# Altium schematic sheet BPF.SchDoc: BPF
size A2 portrait; DocumentNumber: 13; Revision: 1.9; SheetNumber: 13; SheetTotal: 18; DocumentName: Лист 1.SCHDOC
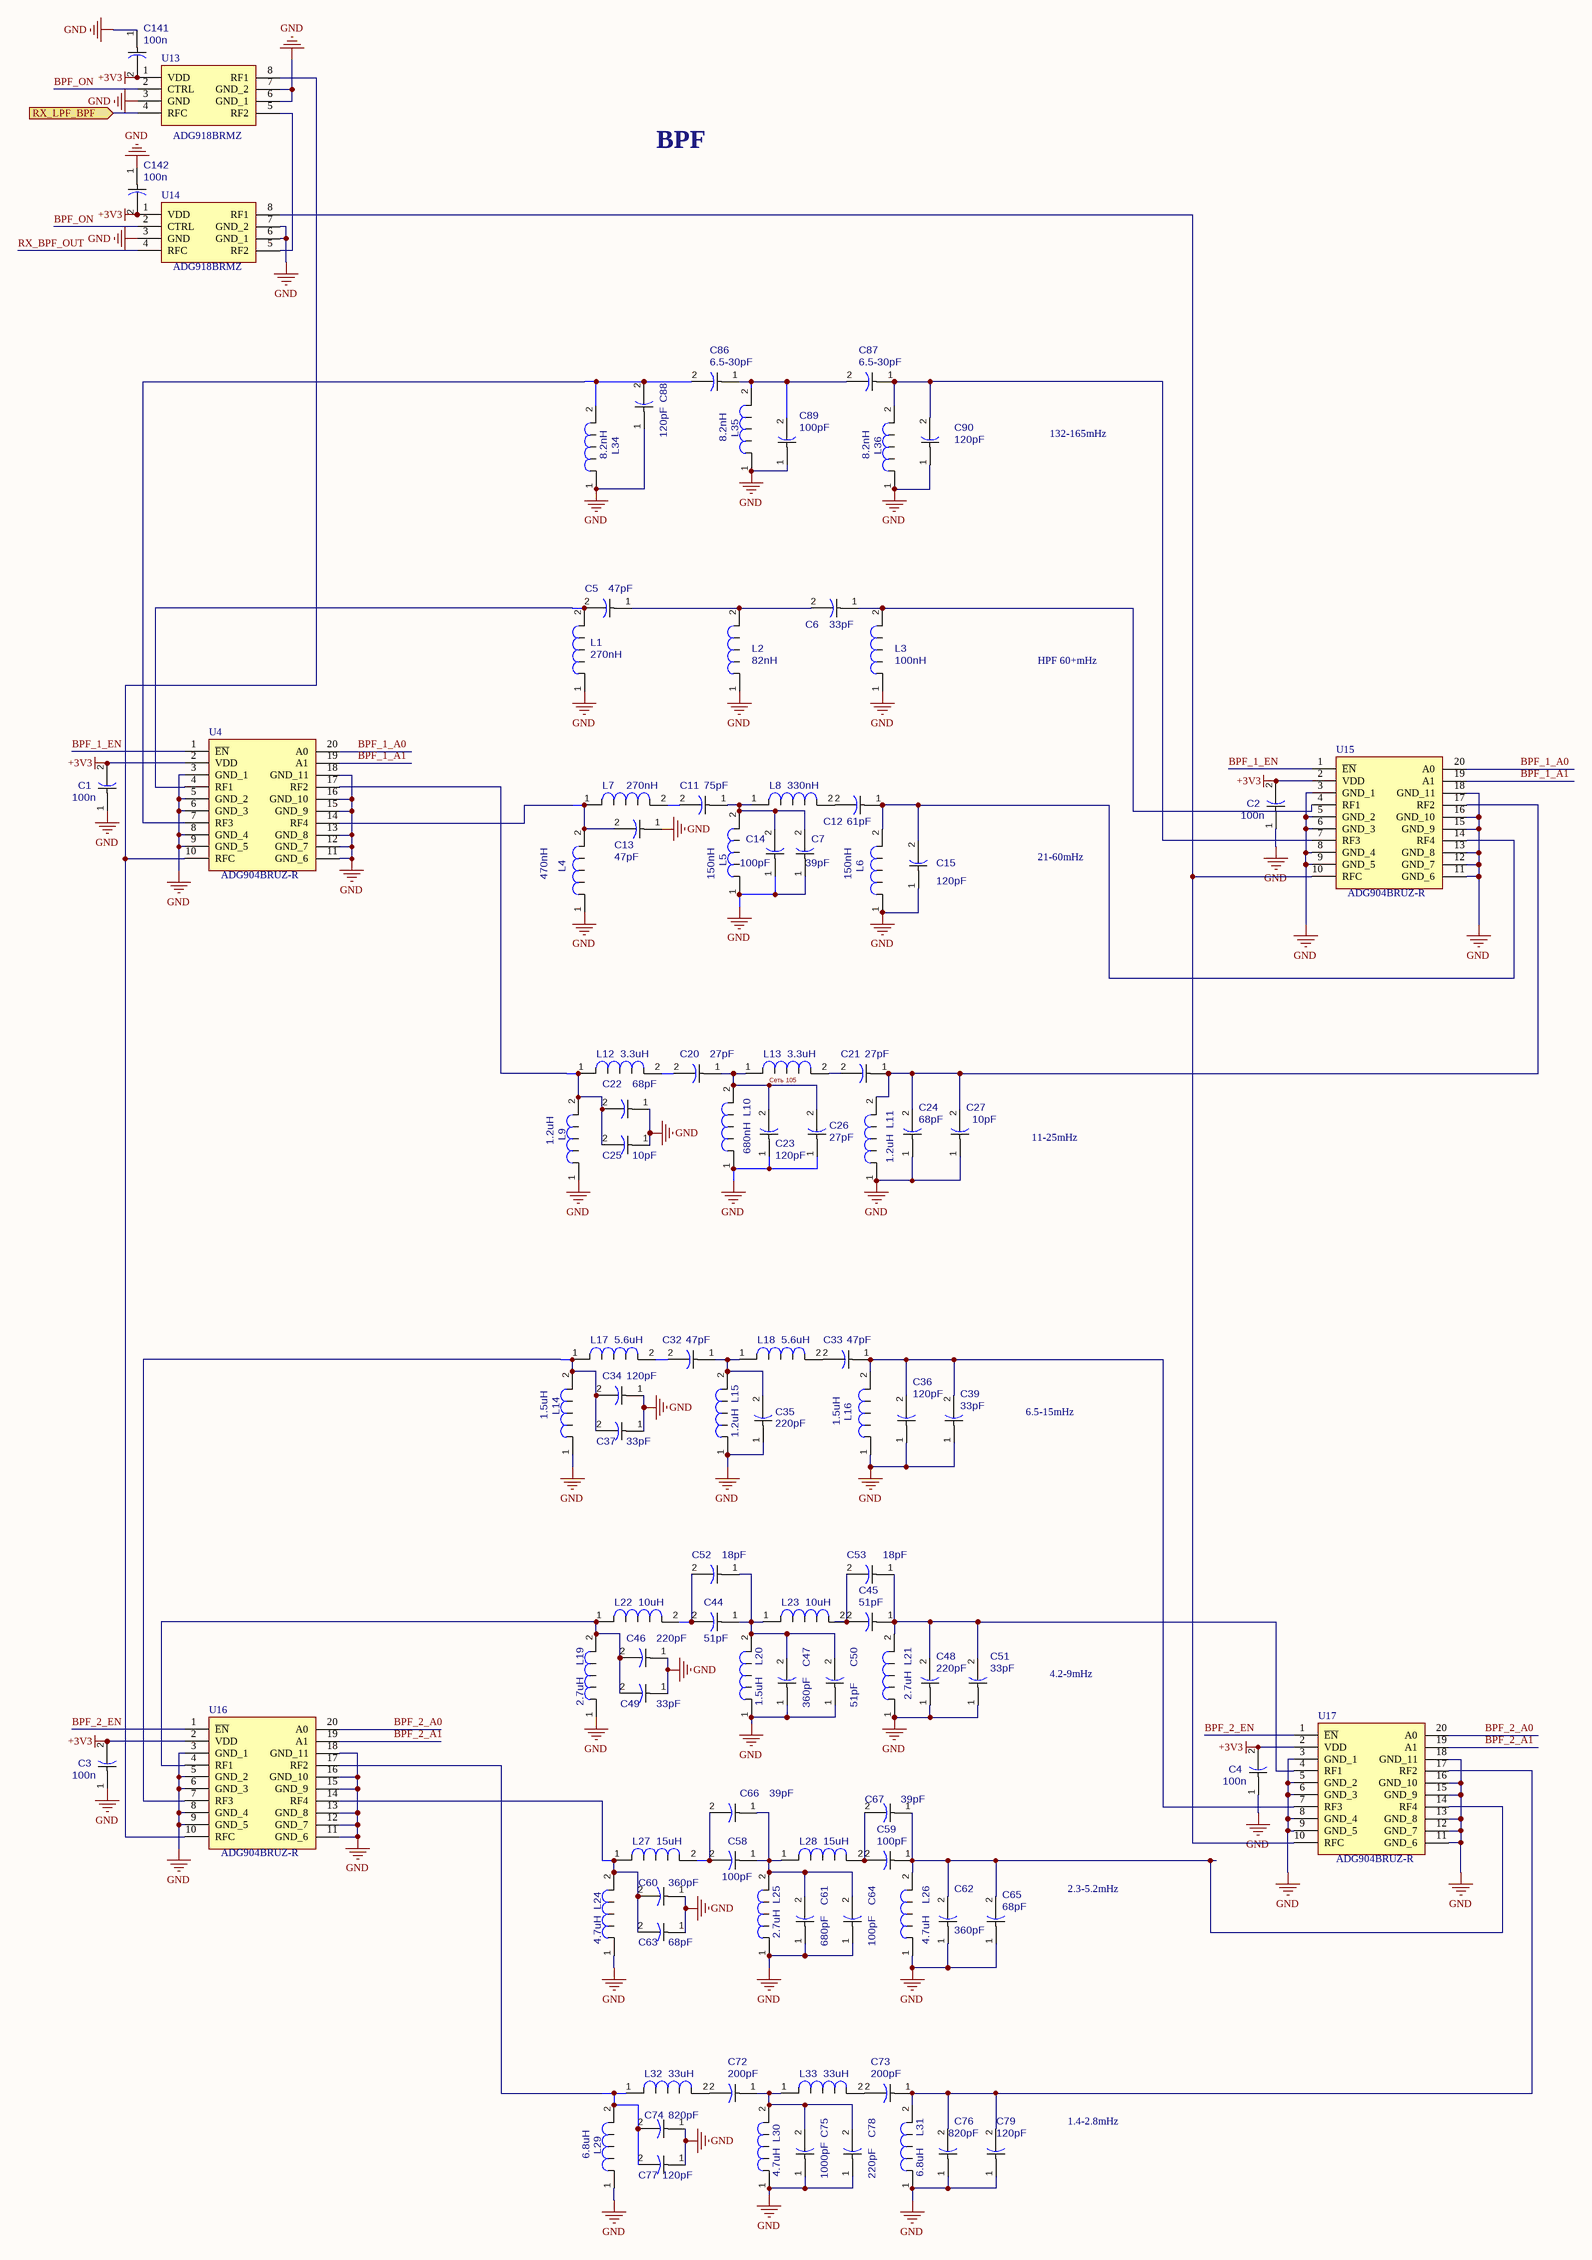
[diagram p0: BPF.SchDoc]

## Parts
C1  value 100n  [CAP_0805]  (hidden comment: CAP_0805)
C2  value 100n  [CAP_0805]  (hidden comment: CAP_0805)
C3  value 100n  [CAP_0805]  (hidden comment: CAP_0805)
C4  value 100n  [CAP_0805]  (hidden comment: CAP_0805)
C5  value 47pF  [CAP_0805]  (hidden comment: CAP_0805)
C6  value 33pF  [CAP_0805]  (hidden comment: CAP_0805)
C7  value 39pF  [CAP_0805]  (hidden comment: CAP_0805)
C11  value 75pF  [CAP_0805]  (hidden comment: CAP_0805)
C12  value 61pF  [CAP_0805]  (hidden comment: CAP_0805)
C13  value 47pF  [CAP_0805]  (hidden comment: CAP_0805)
C14  value 100pF  [CAP_0805]  (hidden comment: CAP_0805)
C15  value 120pF  [CAP_0805]  (hidden comment: CAP_0805)
C20  value 27pF  [CAP_0805]  (hidden comment: CAP_0805)
C21  value 27pF  [CAP_0805]  (hidden comment: CAP_0805)
C22  value 68pF  [CAP_0805]  (hidden comment: CAP_0805)
C23  value 120pF  [CAP_0805]  (hidden comment: CAP_0805)
C24  value 68pF  [CAP_0805]  (hidden comment: CAP_0805)
C25  value 10pF  [CAP_0805]  (hidden comment: CAP_0805)
C26  value 27pF  [CAP_0805]  (hidden comment: CAP_0805)
C27  value 10pF  [CAP_0805]  (hidden comment: CAP_0805)
C32  value 47pF  [CAP_0805]  (hidden comment: CAP_0805)
C33  value 47pF  [CAP_0805]  (hidden comment: CAP_0805)
C34  value 120pF  [CAP_0805]  (hidden comment: CAP_0805)
C35  value 220pF  [CAP_0805]  (hidden comment: CAP_0805)
C36  value 120pF  [CAP_0805]  (hidden comment: CAP_0805)
C37  value 33pF  [CAP_0805]  (hidden comment: CAP_0805)
C39  value 33pF  [CAP_0805]  (hidden comment: CAP_0805)
C44  value 51pF  [CAP_0805]  (hidden comment: CAP_0805)
C45  value 51pF  [CAP_0805]  (hidden comment: CAP_0805)
C46  value 220pF  [CAP_0805]  (hidden comment: CAP_0805)
C47  value 360pF  [CAP_0805]  (hidden comment: CAP_0805)
C48  value 220pF  [CAP_0805]  (hidden comment: CAP_0805)
C49  value 33pF  [CAP_0805]  (hidden comment: CAP_0805)
C50  value 51pF  [CAP_0805]  (hidden comment: CAP_0805)
C51  value 33pF  [CAP_0805]  (hidden comment: CAP_0805)
C52  value 18pF  [CAP_0805]  (hidden comment: CAP_0805)
C53  value 18pF  [CAP_0805]  (hidden comment: CAP_0805)
C58  value 100pF  [CAP_0805]  (hidden comment: CAP_0805)
C59  value 100pF  [CAP_0805]  (hidden comment: CAP_0805)
C60  value 360pF  [CAP_0805]  (hidden comment: CAP_0805)
C61  value 680pF  [CAP_0805]  (hidden comment: CAP_0805)
C62  value 360pF  [CAP_0805]  (hidden comment: CAP_0805)
C63  value 68pF  [CAP_0805]  (hidden comment: CAP_0805)
C64  value 100pF  [CAP_0805]  (hidden comment: CAP_0805)
C65  value 68pF  [CAP_0805]  (hidden comment: CAP_0805)
C66  value 39pF  [CAP_0805]  (hidden comment: CAP_0805)
C67  value 39pF  [CAP_0805]  (hidden comment: CAP_0805)
C72  value 200pF  [CAP_0805]  (hidden comment: CAP_0805)
C73  value 200pF  [CAP_0805]  (hidden comment: CAP_0805)
C74  value 820pF  [CAP_0805]  (hidden comment: CAP_0805)
C75  value 1000pF  [CAP_0805]  (hidden comment: CAP_0805)
C76  value 820pF  [CAP_0805]  (hidden comment: CAP_0805)
C77  value 120pF  [CAP_0805]  (hidden comment: CAP_0805)
C78  value 220pF  [CAP_0805]  (hidden comment: CAP_0805)
C79  value 120pF  [CAP_0805]  (hidden comment: CAP_0805)
C86  value 6.5-30pF  [5025[2010]]  (hidden comment: CAP_0805)
C87  value 6.5-30pF  [5025[2010]]  (hidden comment: CAP_0805)
C88  value 120pF  [CAP_0805]  (hidden comment: CAP_0805)
C89  value 100pF  [CAP_0805]  (hidden comment: CAP_0805)
C90  value 120pF  [CAP_0805]  (hidden comment: CAP_0805)
C141  value 100n  [CAP_0805]  (hidden comment: CAP_0805)
C142  value 100n  [CAP_0805]  (hidden comment: CAP_0805)
L1  value 270nH  [IND_0805]  (hidden comment: IND_0805)
L2  value 82nH  [IND_0805]  (hidden comment: IND_0805)
L3  value 100nH  [IND_0805]  (hidden comment: IND_0805)
L4  value 470nH  [IND_0805]  (hidden comment: IND_0805)
L5  value 150nH  [IND_0805]  (hidden comment: IND_0805)
L6  value 150nH  [IND_0805]  (hidden comment: IND_0805)
L7  value 270nH  [IND_0805]  (hidden comment: IND_0805)
L8  value 330nH  [IND_0805]  (hidden comment: IND_0805)
L9  value 1.2uH  [IND_0805]  (hidden comment: IND_0805)
L10  value 680nH  [IND_0805]  (hidden comment: IND_0805)
L11  value 1.2uH  [IND_0805]  (hidden comment: IND_0805)
L12  value 3.3uH  [IND_0805]  (hidden comment: IND_0805)
L13  value 3.3uH  [IND_0805]  (hidden comment: IND_0805)
L14  value 1.5uH  [IND_0805]  (hidden comment: IND_0805)
L15  value 1.2uH  [IND_0805]  (hidden comment: IND_0805)
L16  value 1.5uH  [IND_0805]  (hidden comment: IND_0805)
L17  value 5.6uH  [IND_0805]  (hidden comment: IND_0805)
L18  value 5.6uH  [IND_0805]  (hidden comment: IND_0805)
L19  value 2.7uH  [IND_0805]  (hidden comment: IND_0805)
L20  value 1.5uH  [IND_0805]  (hidden comment: IND_0805)
L21  value 2.7uH  [IND_0805]  (hidden comment: IND_0805)
L22  value 10uH  [IND_0805]  (hidden comment: IND_0805)
L23  value 10uH  [IND_0805]  (hidden comment: IND_0805)
L24  value 4.7uH  [IND_0805]  (hidden comment: IND_0805)
L25  value 2.7uH  [IND_0805]  (hidden comment: IND_0805)
L26  value 4.7uH  [IND_0805]  (hidden comment: IND_0805)
L27  value 15uH  [IND_0805]  (hidden comment: IND_0805)
L28  value 15uH  [IND_0805]  (hidden comment: IND_0805)
L29  value 6.8uH  [IND_0805]  (hidden comment: IND_0805)
L30  value 4.7uH  [IND_0805]  (hidden comment: IND_0805)
L31  value 6.8uH  [IND_0805]  (hidden comment: IND_0805)
L32  value 33uH  [IND_0805]  (hidden comment: IND_0805)
L33  value 33uH  [IND_0805]  (hidden comment: IND_0805)
L34  value 8.2nH  [IND_0805]  (hidden comment: IND_0805)
L35  value 8.2nH  [IND_0805]  (hidden comment: IND_0805)
L36  value 8.2nH  [IND_0805]  (hidden comment: IND_0805)
U4  ADG904BRUZ-R  [SOP65P640X120-20N]
U13  ADG918BRMZ  [SOP65P490X110-8N]
U14  ADG918BRMZ  [SOP65P490X110-8N]
U15  ADG904BRUZ-R  [SOP65P640X120-20N]
U16  ADG904BRUZ-R  [SOP65P640X120-20N]
U17  ADG904BRUZ-R  [SOP65P640X120-20N]

## Ports
RX_LPF_BPF (in)

## Nets
+3V3: C1.2 C2.2 C3.2 C4.2 C141.2 C142.2 U4.2(VDD) U13.1(VDD) U14.1(VDD) U15.2(VDD) U16.2(VDD) U17.2(VDD)
GND: C1.1 C2.1 C3.1 C4.1 C7.1 C13.1 C14.1 C15.1 C22.1 C23.1 C24.1 C25.1 C26.1 C27.1 C34.1 C35.1 C36.1 C37.1 C39.1 C46.1 C47.1 C48.1 C49.1 C50.1 C51.1 C60.1 C61.1 C62.1 C63.1 C64.1 C65.1 C74.1 C75.1 C76.1 C77.1 C78.1 C79.1 C88.1 C89.1 C90.1 C141.1 C142.1 L1.1 L2.1 L3.1 L4.1 L5.1 L6.1 L9.1 L10.1 L11.1 L14.1 L15.1 L16.1 L19.1 L20.1 L21.1 L24.1 L25.1 L26.1 L29.1 L30.1 L31.1 L34.1 L35.1 L36.1 U4.3(GND_1) U4.5(GND_2) U4.6(GND_3) U4.8(GND_4) U4.9(GND_5) U4.11(GND_6) U4.12(GND_7) U4.13(GND_8) U4.15(GND_9) U4.16(GND_10) U4.18(GND_11) U13.3(GND) U13.6(GND_1) U13.7(GND_2) U14.3(GND) U14.6(GND_1) U14.7(GND_2) U15.3(GND_1) U15.5(GND_2) U15.6(GND_3) U15.8(GND_4) U15.9(GND_5) U15.11(GND_6) U15.12(GND_7) U15.13(GND_8) U15.15(GND_9) U15.16(GND_10) U15.18(GND_11) U16.3(GND_1) U16.5(GND_2) U16.6(GND_3) U16.8(GND_4) U16.9(GND_5) U16.11(GND_6) U16.12(GND_7) U16.13(GND_8) U16.15(GND_9) U16.16(GND_10) U16.18(GND_11) U17.3(GND_1) U17.5(GND_2) U17.6(GND_3) U17.8(GND_4) U17.9(GND_5) U17.11(GND_6) U17.12(GND_7) U17.13(GND_8) U17.15(GND_9) U17.16(GND_10) U17.18(GND_11)
BPF_1_A0: U4.20(A0) U15.20(A0)
BPF_1_A1: U4.19(A1) U15.19(A1)
BPF_1_EN: U4.1(~{EN}) U15.1(~{EN})
BPF_2_A0: U16.20(A0) U17.20(A0)
BPF_2_A1: U16.19(A1) U17.19(A1)
BPF_2_EN: U16.1(~{EN}) U17.1(~{EN})
BPF_ON: U13.2(CTRL) U14.2(CTRL)
RX_BPF_OUT: U14.4(RFC)
RX_LPF_BPF: U13.4(RFC) ; port RX_LPF_BPF
Сеть 105: C20.1 C23.2 C26.2 L10.2 L13.1
NetC5_1: C5.1 C6.2 L2.2
NetC5_2: C5.2 L1.2 U4.4(RF1)
NetC6_1: C6.1 L3.2 U15.4(RF1)
NetC7_2: C7.2 C11.1 C14.2 L5.2 L8.1
NetC11_2: C11.2 L7.2
NetC12_1: C12.1 C15.2 L6.2 U15.14(RF4)
NetC12_2: C12.2 L8.2
NetC13_2: C13.2 L4.2 L7.1 U4.14(RF4)
NetC20_2: C20.2 L12.2
NetC21_1: C21.1 C24.2 C27.2 L11.2 U15.17(RF2)
NetC21_2: C21.2 L13.2
NetC22_2: C22.2 C25.2 L9.2 L12.1 U4.17(RF2)
NetC32_1: C32.1 C35.2 L15.2 L18.1
NetC32_2: C32.2 L17.2
NetC33_1: C33.1 C36.2 C39.2 L16.2 U17.7(RF3)
NetC33_2: C33.2 L18.2
NetC34_2: C34.2 C37.2 L14.2 L17.1 U16.7(RF3)
NetC44_1: C44.1 C47.2 C50.2 C52.1 L20.2 L23.1
NetC44_2: C44.2 C52.2 L22.2
NetC45_1: C45.1 C48.2 C51.2 C53.1 L21.2 U17.4(RF1)
NetC45_2: C45.2 C53.2 L23.2
NetC46_2: C46.2 C49.2 L19.2 L22.1 U16.4(RF1)
NetC58_1: C58.1 C61.2 C64.2 C66.1 L25.2 L28.1
NetC58_2: C58.2 C66.2 L27.2
NetC59_1: C59.1 C62.2 C65.2 C67.1 L26.2 U17.14(RF4)
NetC59_2: C59.2 C67.2 L28.2
NetC60_2: C60.2 C63.2 L24.2 L27.1 U16.14(RF4)
NetC72_1: C72.1 C75.2 C78.2 L30.2 L33.1
NetC72_2: C72.2 L32.2
NetC73_1: C73.1 C76.2 C79.2 L31.2 U17.17(RF2)
NetC73_2: C73.2 L33.2
NetC74_2: C74.2 C77.2 L29.2 L32.1 U16.17(RF2)
NetC86_1: C86.1 C87.2 C89.2 L35.2
NetC86_2: C86.2 C88.2 L34.2 U4.7(RF3)
NetC87_1: C87.1 C90.2 L36.2 U15.7(RF3)
NetU4_10: U4.10(RFC) U13.8(RF1) U16.10(RFC)
NetU13_5: U13.5(RF2) U14.5(RF2)
NetU14_8: U14.8(RF1) U15.10(RFC) U17.10(RFC)

## Notes on the sheet
- BPF
- 132-165mHz
- HPF 60+mHz
- 21-60mHz
- 11-25mHz
- 6.5-15mHz
- 4.2-9mHz
- 2.3-5.2mHz
- 1.4-2.8mHz
- Title
- Size:
- Date:
- File:
- A2
- Number:
- Time:
- Revision:
- Sheet
- of

## Library data of the parts
U4 U15-U17 = ADG904BRUZ-R: Integrated Circuit; Manufacturer_Name: Analog Devices; Datasheet Link: http://www.analog.com/static/imported-files/data_sheets/ADG904_904R.pdf; Height: 1.2mm; Manufacturer_Part_Number: ADG904BRUZ-R; Mouser Part Number: 584-ADG904BRUZ-R; Mouser Price/Stock: https://www.mouser.com/Search/Refine.aspx?Keyword=584-ADG904BRUZ-R; RS Part Number: 5385019P; RS Price/Stock: http://uk.rs-online.com/web/p/products/5385019P
U13 U14 = ADG918BRMZ: Integrated Circuit; Manufacturer_Name: Analog Devices; Datasheet Link: http://www.analog.com/static/imported-files/data_sheets/ADG918_919.pdf; Height: 1.1mm; Manufacturer_Part_Number: ADG918BRMZ; Mouser Part Number: 584-ADG918BRMZ; Mouser Price/Stock: https://www.mouser.co.uk/ProductDetail/Analog-Devices/ADG918BRMZ?qs=BpaRKvA4VqHrp1TCwMhfnw%3D%3D; RS Part Number: 4969212P; RS Price/Stock: http://uk.rs-online.com/web/p/products/4969212P